# EasyEDA Pro project pickle_risc.epro, schematic Schematic1
Board Name: Register file; Create Date: 2025-10-07; Page Name: P1; Project Name: pickle_risc; Schematic Name: Schematic1; Update Date: 2025-12-06; Company: EasyEDA.com; Page Size: A4; Version: V1.0
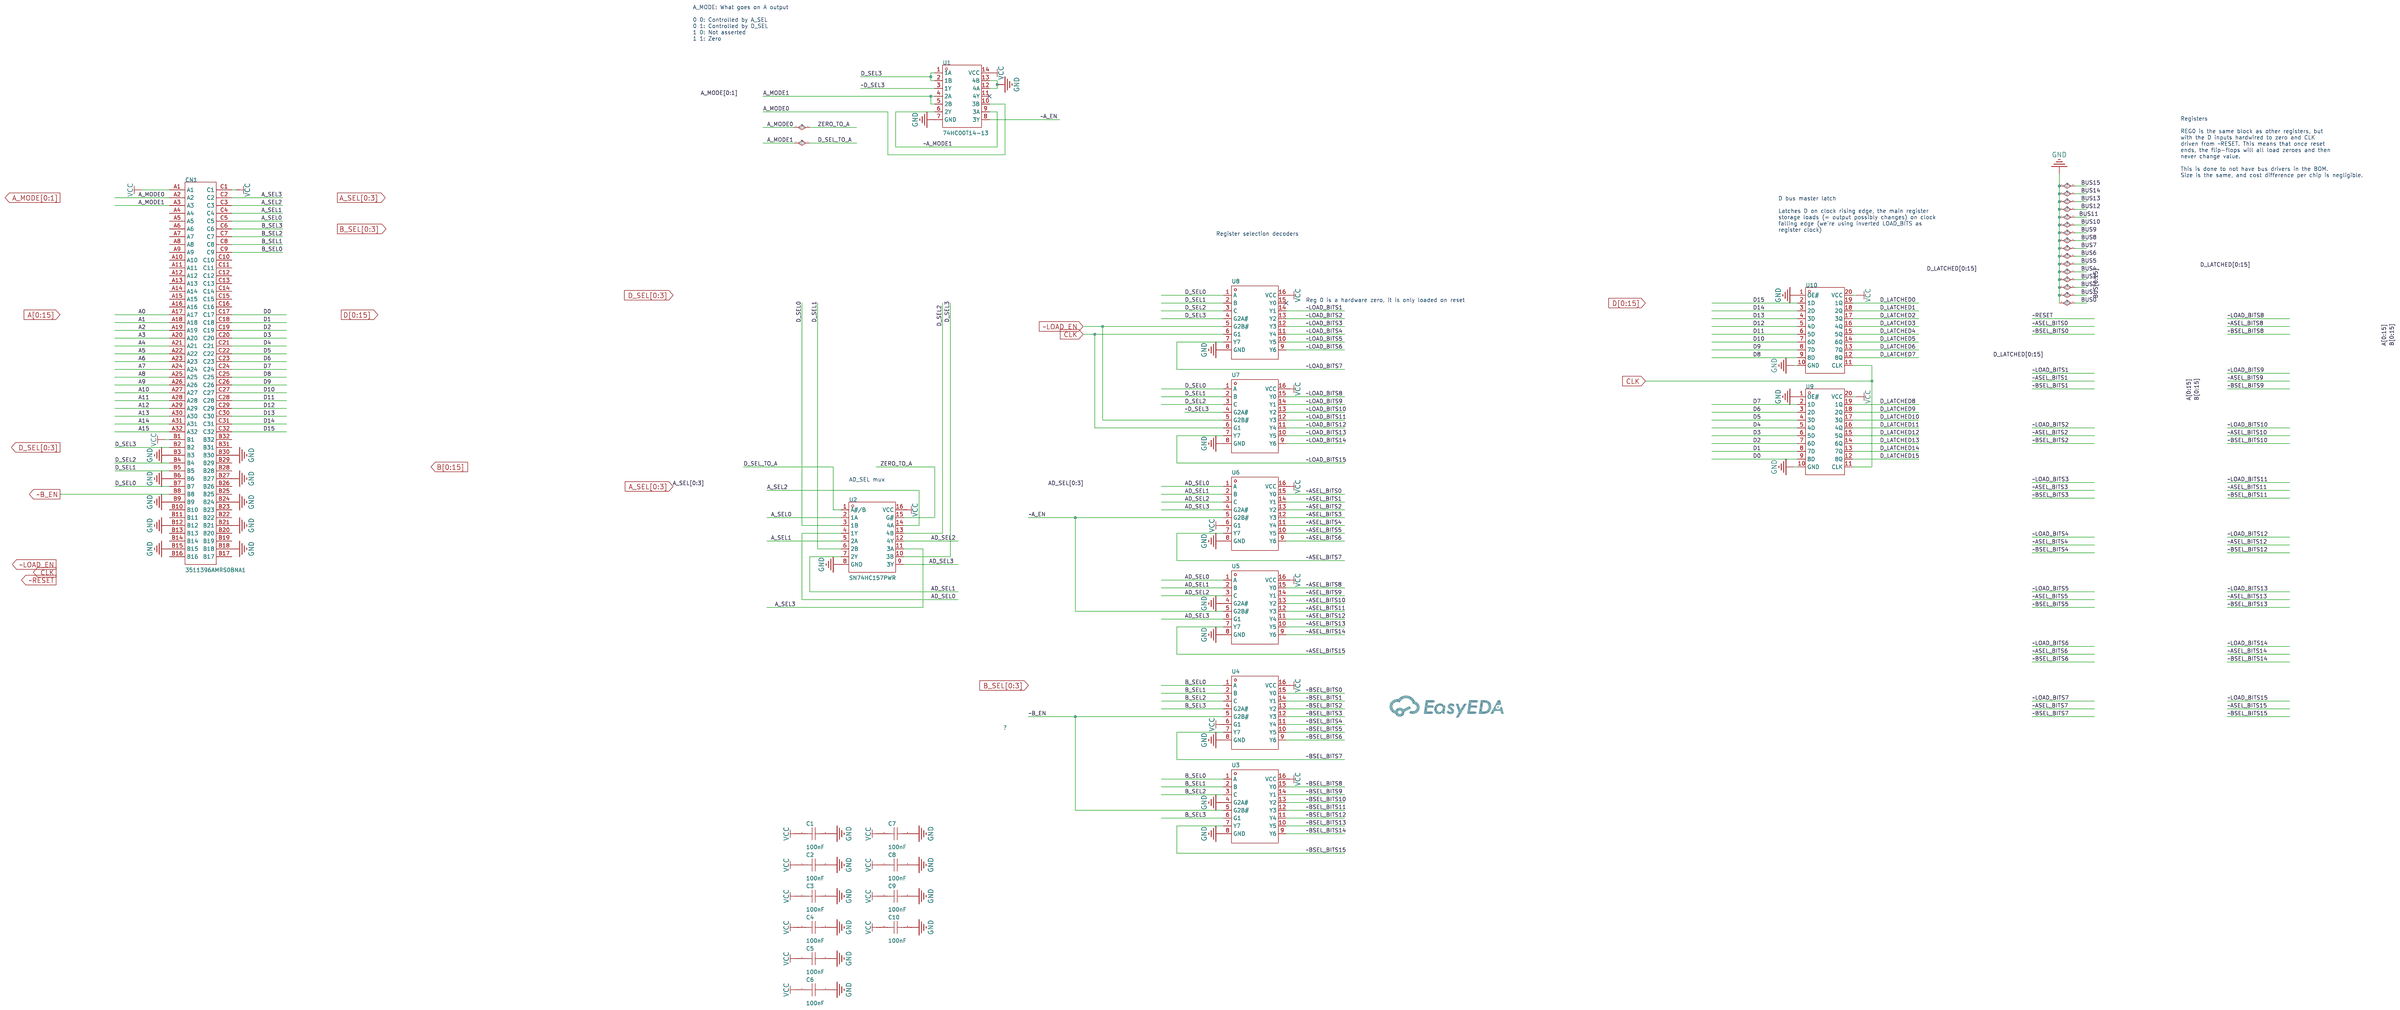
[diagram p0: schematic sheet]

## Parts
C1  100nF  [C0603]
C2  100nF  [C0603]
C3  100nF  [C0603]
C4  100nF  [C0603]
C5  100nF  [C0603]
C6  100nF  [C0603]
C7  100nF  [C0603]
C8  100nF  [C0603]
C9  100nF  [C0603]
C10  100nF  [C0603]
CN1  3511396AMRS0BNA1  [CONN-TH_3511396AMRS0BNA1]
REG0  -
REG1  -
REG2  -
REG3  -
REG4  -
REG5  -
REG6  -
REG7  -
REG8  -
REG9  -
REG10  -
REG11  -
REG12  -
REG13  -
REG14  -
REG15  -
U1  74HC00T14-13  [TSSOP-14_L5.0-W4.4-P0.65-LS6.4-BL]
U2  SN74HC157PWR  [TSSOP-16_L5.0-W4.4-P0.65-LS6.4-BL]
U3  SN74HC138PWR  [TSSOP-16_L5.0-W4.4-P0.65-LS6.4-BL]
U4  SN74HC138PWR  [TSSOP-16_L5.0-W4.4-P0.65-LS6.4-BL]
U5  SN74HC138PWR  [TSSOP-16_L5.0-W4.4-P0.65-LS6.4-BL]
U6  SN74HC138PWR  [TSSOP-16_L5.0-W4.4-P0.65-LS6.4-BL]
U7  SN74HC138PWR  [TSSOP-16_L5.0-W4.4-P0.65-LS6.4-BL]
U8  SN74HC138PWR  [TSSOP-16_L5.0-W4.4-P0.65-LS6.4-BL]
U9  SN74HC574PWR  [TSSOP-20_L6.5-W4.4-P0.65-LS6.4-BL]
U10  SN74HC574PWR  [TSSOP-20_L6.5-W4.4-P0.65-LS6.4-BL]

## Library data of the parts
C1-C10 = CC0603KRX7R9BB104: Capacitance:100nF Tolerance:±10% Tolerance:±10% Voltage Rating:50V Temperature Coefficient:X7R; LCSC Part Name: 100nF ±10% 50V; Supplier Part: C14663; Manufacturer: YAGEO(国巨); Supplier Footprint: 0603; JLCPCB Part Class: Basic Part; Datasheet: https://item.szlcsc.com/datasheet/CC0603KRX7R9BB104/15331.html; Supplier: LCSC; Tolerance: ±10%; Voltage Rating: 50V; Temperature Coefficient: X7R
CN1 = 3511396AMRS0BNA1: Number of Pins:96P Pitch:2.54mm Mounting Type:Right Angle Number of Rows:3 Current Rating:3A Contact Material:Brass Contact Plating:Gold Operating Temperature:-40℃~+105℃ Operating Temperature:-40℃~+105℃; LCSC Part Name: PIN:96P 间距:2.54mm 弯插; Supplier Part: C963727; Manufacturer: JILN(锦凌); Supplier Footprint: 弯插,P=2.54mm; JLCPCB Part Class: Extended Part; Datasheet: https://item.szlcsc.com/datasheet/3511396AMRS0BNA1/1048160.html; Supplier: LCSC; Number of Pins: 96P; Pitch: 2.54mm; Mounting Type: Right Angle; Number of Rows: 3; Current Rating: 3A; Contact Material: Brass; Contact Plating: Gold; Operating Temperature: -40℃~+105℃
U1 = 74HC00T14-13: Logic Type:NAND Gate Number of Channels:4 Voltage - Supply:2V~6V Voltage - Supply:2V~6V Quiescent Current:20uA Current - Output Low(IOL):5.2mA Current - Output High(IOH):5.2mA Input Logic Level - High:1.5V~4.2V Input Logic Level - High:1.5V~4.2V Input Log; LCSC Part Name: 四组 2 输入与非门; Supplier Part: C842429; Manufacturer: DIODES(美台); Supplier Footprint: TSSOP-14; JLCPCB Part Class: Extended Part; Datasheet: https://item.szlcsc.com/datasheet/74HC00T14-13/900760.html; Supplier: LCSC; Logic Type: NAND Gate; Number of Channels: 4; Voltage - Supply: 2V~6V; Quiescent Current: 20uA; Current - Output Low(IOL): 5.2mA; Current - Output High(IOH): 5.2mA; Input Logic Level - High: 1.5V~4.2V; Input Logic Level - Low: 500mV~1.8V; Output Logic Level - High: 5.9V；1.9V；4.4V; Output Logic Level - Low: 100mV；330mV; Series: 74HC Series; Propagation Delay: 15ns@6V,50pF; Operating Temperature: -40℃~+125℃; Input Number: 2
U2 = SN74HC157PWR: Type:- Voltage Supply Source:Single Supply Voltage - Supply:2V~6V Voltage - Supply:2V~6V Current - Output Low(IOL):7.8mA Current - Output High(IOH):7.8mA Operating temperature:-40℃~+85℃ Operating temperature:-40℃~+85℃ Propagation Delay:21ns@6V,50pF Quiesc; LCSC Part Name: 四路2选1数据选择器/多路复用器; Supplier Part: C408973; Manufacturer: TI(德州仪器); Supplier Footprint: TSSOP-16; JLCPCB Part Class: Extended Part; Datasheet: https://www.ti.com/cn/lit/gpn/sn74hc157; Supplier: LCSC; Voltage Supply Source: Single Supply; Voltage - Supply: 2V~6V; Current - Output Low(IOL): 7.8mA; Current - Output High(IOH): 7.8mA; Operating temperature: -40℃~+85℃; Propagation Delay: 21ns@6V,50pF; Quiescent Current: 80uA
U3-U8 = SN74HC138PWR: Type:Decoder/Demultiplexer Voltage Supply Source:Single Supply Voltage - Supply:2V~6V Voltage - Supply:2V~6V Current - Output Low(IOL):5.2mA Current - Output High(IOH):5.2mA Operating temperature:-40℃~+85℃ Operating temperature:-40℃~+85℃; Supplier Part: C157527; Manufacturer: TI(德州仪器); Supplier Footprint: TSSOP-16; JLCPCB Part Class: Extended Part; Datasheet: https://www.ti.com/cn/lit/gpn/sn74hc138; Supplier: LCSC; Type: Decoder/Demultiplexer; Voltage Supply Source: Single Supply; Voltage - Supply: 2V~6V; Current - Output Low(IOL): 5.2mA; Current - Output High(IOH): 5.2mA; Operating temperature: -40℃~+85℃
U9 U10 = SN74HC574PWR: Type:D-Type Trigger Type:Rising Edge Voltage - Supply:2V~6V Voltage - Supply:2V~6V Clock Frequency:40MHz Function:- Number of Elements:1 Number of Bits per Element:8 Output Type:Tri-State Propagation Delay:31ns@6V,50pF Series:74HC Series Current - Output; Supplier Part: C132111; Manufacturer: TI(德州仪器); Supplier Footprint: TSSOP-20; JLCPCB Part Class: Extended Part; Datasheet: https://www.ti.com/cn/lit/gpn/sn74hc574; Supplier: LCSC; Type: D-Type; Trigger Type: Rising Edge; Voltage - Supply: 2V~6V; Clock Frequency: 40MHz; Number of Elements: 1; Number of Bits per Element: 8; Output Type: Tri-State; Propagation Delay: 31ns@6V,50pF; Series: 74HC Series; Current - Output Low(IOL): 7.8mA; Current - Output High(IOH): 7.8mA; Quiescent Current: 8uA; Input Capacitance: 3pF; Operating Temperature: -40℃~+85℃; Setup Time: 21ns; Hold Time: 5ns

## Nets
GND: C1.2 C2.2 C3.2 C4.2 C5.2 C6.2 C7.2 C8.2 C9.2 C10.2 CN1.B3 CN1.B6 CN1.B9 CN1.B12 CN1.B15 CN1.B18 CN1.B21 CN1.B24 CN1.B27 CN1.B30 U1.7(GND) U1.12(4A) U1.13(4B) U2.8(GND) U3.4(G2A#) U3.8(GND) U4.8(GND) U5.4(G2A#) U5.8(GND) U6.8(GND) U7.8(GND) U8.8(GND) U9.1(OE#) U9.10(GND) U10.1(OE#) U10.10(GND)
VCC: C1.1 C2.1 C3.1 C4.1 C5.1 C6.1 C7.1 C8.1 C9.1 C10.1 CN1.A1 CN1.B1 CN1.C1 U1.14(VCC) U2.16(VCC) U3.16(VCC) U4.6(G1) U4.16(VCC) U5.16(VCC) U6.6(G1) U6.16(VCC) U7.16(VCC) U8.16(VCC) U9.20(VCC) U10.20(VCC)
A0: CN1.A17
A1: CN1.A18
A2: CN1.A19
A3: CN1.A20
A4: CN1.A21
A5: CN1.A22
A6: CN1.A23
A7: CN1.A24
A8: CN1.A25
A9: CN1.A26
A10: CN1.A27
A11: CN1.A28
A12: CN1.A29
A13: CN1.A30
A14: CN1.A31
A15: CN1.A32
A_MODE0: CN1.A2 U1.10(3B) U2.15(G#)
A_MODE1: CN1.A3 U1.4(2A) U1.5(2B) U2.1(A#/B)
A_SEL0: CN1.C5 U2.2(1A)
A_SEL1: CN1.C4 U2.5(2A)
A_SEL2: CN1.C3 U2.14(4A)
A_SEL3: CN1.C2 U2.11(3A)
AD_SEL0: U2.4(1Y) U5.1(A) U6.1(A)
AD_SEL1: U2.7(2Y) U5.2(B) U6.2(B)
AD_SEL2: U2.12(4Y) U5.3(C) U6.3(C)
AD_SEL3: U2.9(3Y) U5.6(G1) U6.4(G2A#)
B_SEL0: CN1.C9 U3.1(A) U4.1(A)
B_SEL1: CN1.C8 U3.2(B) U4.2(B)
B_SEL2: CN1.C7 U3.3(C) U4.3(C)
B_SEL3: CN1.C6 U3.6(G1) U4.4(G2A#)
CLK: U7.6(G1) U8.6(G1) U9.11(CLK) U10.11(CLK)
D0: CN1.C17 U9.9(8D)
D1: CN1.C18 U9.8(7D)
D2: CN1.C19 U9.7(6D)
D3: CN1.C20 U9.6(5D)
D4: CN1.C21 U9.5(4D)
D5: CN1.C22 U9.4(3D)
D6: CN1.C23 U9.3(2D)
D7: CN1.C24 U9.2(1D)
D8: CN1.C25 U10.9(8D)
D9: CN1.C26 U10.8(7D)
D10: CN1.C27 U10.7(6D)
D11: CN1.C28 U10.6(5D)
D12: CN1.C29 U10.5(4D)
D13: CN1.C30 U10.4(3D)
D14: CN1.C31 U10.3(2D)
D15: CN1.C32 U10.2(1D)
D_LATCHED0: U10.19(1Q)
D_LATCHED1: U10.18(2Q)
D_LATCHED2: U10.17(3Q)
D_LATCHED3: U10.16(4Q)
D_LATCHED4: U10.15(5Q)
D_LATCHED5: U10.14(6Q)
D_LATCHED6: U10.13(7Q)
D_LATCHED7: U10.12(8Q)
D_LATCHED8: U9.19(1Q)
D_LATCHED9: U9.18(2Q)
D_LATCHED10: U9.17(3Q)
D_LATCHED11: U9.16(4Q)
D_LATCHED12: U9.15(5Q)
D_LATCHED13: U9.14(6Q)
D_LATCHED14: U9.13(7Q)
D_LATCHED15: U9.12(8Q)
D_SEL0: CN1.B7 U2.3(1B) U7.1(A) U8.1(A)
D_SEL1: CN1.B5 U2.6(2B) U7.2(B) U8.2(B)
D_SEL2: CN1.B4 U2.13(4B) U7.3(C) U8.3(C)
D_SEL3: CN1.B2 U1.1(1A) U1.2(1B) U2.10(3B) U8.4(G2A#)
~A_EN: U1.8(3Y) U5.5(G2B#) U6.5(G2B#)
~A_MODE1: U1.6(2Y) U1.9(3A)
~ASEL_BITS0: REG0.10(~EN_A) U6.15(Y0)
~ASEL_BITS1: REG1.10(~EN_A) U6.14(Y1)
~ASEL_BITS2: REG2.10(~EN_A) U6.13(Y2)
~ASEL_BITS3: REG3.10(~EN_A) U6.12(Y3)
~ASEL_BITS4: REG4.10(~EN_A) U6.11(Y4)
~ASEL_BITS5: REG5.10(~EN_A) U6.10(Y5)
~ASEL_BITS6: REG6.10(~EN_A) U6.9(Y6)
~ASEL_BITS7: REG7.10(~EN_A) U6.7(Y7)
~ASEL_BITS8: REG8.10(~EN_A) U5.15(Y0)
~ASEL_BITS9: REG9.10(~EN_A) U5.14(Y1)
~ASEL_BITS10: REG10.10(~EN_A) U5.13(Y2)
~ASEL_BITS11: REG11.10(~EN_A) U5.12(Y3)
~ASEL_BITS12: REG12.10(~EN_A) U5.11(Y4)
~ASEL_BITS13: REG13.10(~EN_A) U5.10(Y5)
~ASEL_BITS14: REG14.10(~EN_A) U5.9(Y6)
~ASEL_BITS15: REG15.10(~EN_A) U5.7(Y7)
~B_EN: CN1.B8 U3.5(G2B#) U4.5(G2B#)
~BSEL_BITS0: REG0.11(~EN_B) U4.15(Y0)
~BSEL_BITS1: REG1.11(~EN_B) U4.14(Y1)
~BSEL_BITS2: REG2.11(~EN_B) U4.13(Y2)
~BSEL_BITS3: REG3.11(~EN_B) U4.12(Y3)
~BSEL_BITS4: REG4.11(~EN_B) U4.11(Y4)
~BSEL_BITS5: REG5.11(~EN_B) U4.10(Y5)
~BSEL_BITS6: REG6.11(~EN_B) U4.9(Y6)
~BSEL_BITS7: REG7.11(~EN_B) U4.7(Y7)
~BSEL_BITS8: REG8.11(~EN_B) U3.15(Y0)
~BSEL_BITS9: REG9.11(~EN_B) U3.14(Y1)
~BSEL_BITS10: REG10.11(~EN_B) U3.13(Y2)
~BSEL_BITS11: REG11.11(~EN_B) U3.12(Y3)
~BSEL_BITS12: REG12.11(~EN_B) U3.11(Y4)
~BSEL_BITS13: REG13.11(~EN_B) U3.10(Y5)
~BSEL_BITS14: REG14.11(~EN_B) U3.9(Y6)
~BSEL_BITS15: REG15.11(~EN_B) U3.7(Y7)
~D_SEL3: U1.3(1Y) U7.4(G2A#)
~LOAD_BITS1: REG1.9(CLK) U8.14(Y1)
~LOAD_BITS2: REG2.9(CLK) U8.13(Y2)
~LOAD_BITS3: REG3.9(CLK) U8.12(Y3)
~LOAD_BITS4: REG4.9(CLK) U8.11(Y4)
~LOAD_BITS5: REG5.9(CLK) U8.10(Y5)
~LOAD_BITS6: REG6.9(CLK) U8.9(Y6)
~LOAD_BITS7: REG7.9(CLK) U8.7(Y7)
~LOAD_BITS8: REG8.9(CLK) U7.15(Y0)
~LOAD_BITS9: REG9.9(CLK) U7.14(Y1)
~LOAD_BITS10: REG10.9(CLK) U7.13(Y2)
~LOAD_BITS11: REG11.9(CLK) U7.12(Y3)
~LOAD_BITS12: REG12.9(CLK) U7.11(Y4)
~LOAD_BITS13: REG13.9(CLK) U7.10(Y5)
~LOAD_BITS14: REG14.9(CLK) U7.9(Y6)
~LOAD_BITS15: REG15.9(CLK) U7.7(Y7)
~LOAD_EN: U7.5(G2B#) U8.5(G2B#)
~RESET: REG0.9(CLK)

Not connected (* = marked no-connect by the designer): CN1 A4 A5 A6 A7 A8 A9 A10 A11 A12 A13 A14 A15 A16 B10 B11 B13 B14 B16 B17 B19 B20 B22 B23 B25 B26 B28 B29 B31 B32 C10 C11 C12 C13 C14 C15 C16; REG0 (B[0:15]); REG1 (B[0:15]); REG2 (B[0:15]); REG3 (B[0:15]); REG4 (B[0:15]); REG5 (B[0:15]); REG6 (B[0:15]); REG7 (B[0:15]); REG8 (B[0:15]); REG9 (B[0:15]); REG10 (B[0:15]); REG11 (B[0:15]); REG12 (B[0:15]); REG13 (B[0:15]); REG14 (B[0:15]); REG15 (B[0:15]); U1 11(4Y)*; U8 15(Y0)*

## Notes on the sheet
- A_MODE: What goes on A output
  0 0: Controlled by A_SEL
  0 1: Controlled by D_SEL
  1 0: Not asserted
  1 1: Zero
- Registers
  REG0 is the same block as other registers, but
  with the D inputs hardwired to zero and CLK
  driven from ~RESET. This means that once reset
  ends, the flip-flops will all load zeroes and then
  never change value.
  This is done to not have bus drivers in the BOM.
  Size is the same, and cost difference per chip is negligible.
- Register selection decoders
- D bus master latch
  Latches D on clock rising edge, the main register
  storage loads (= output possibly changes) on clock
  falling edge (we're using inverted LOAD_BITS as
  register clock)
- Reg 0 is a hardware zero, it is only loaded on reset
- AD_SEL mux
